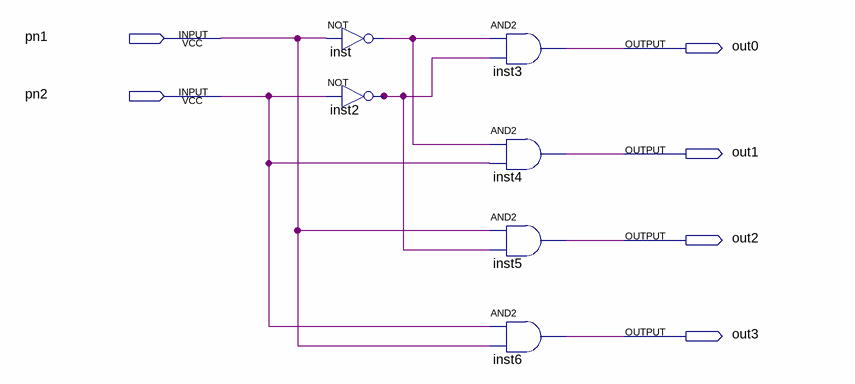
[diagram p0: schematic sheet]
// Quartus schematic decodificador.bdf as structural Verilog: 6 symbols, 6 pins
module decodificador (
  input  pn1,
  input  pn2,
  output out0,
  output out1,
  output out2,
  output out3
);

  wire inst2_out, inst_out;

  not inst (inst_out, pn1);
  not inst2 (inst2_out, pn2);
  and inst3 (out0, inst_out, inst2_out);
  and inst4 (out1, inst_out, pn2);
  and inst5 (out2, pn1, inst2_out);
  and inst6 (out3, pn2, pn1);
endmodule
